# EAGLE design heart-shaped-smd-light-gift (EAGLE 9.2.0)
CNAME: Máté Horváth

## Sheet 1 of 2
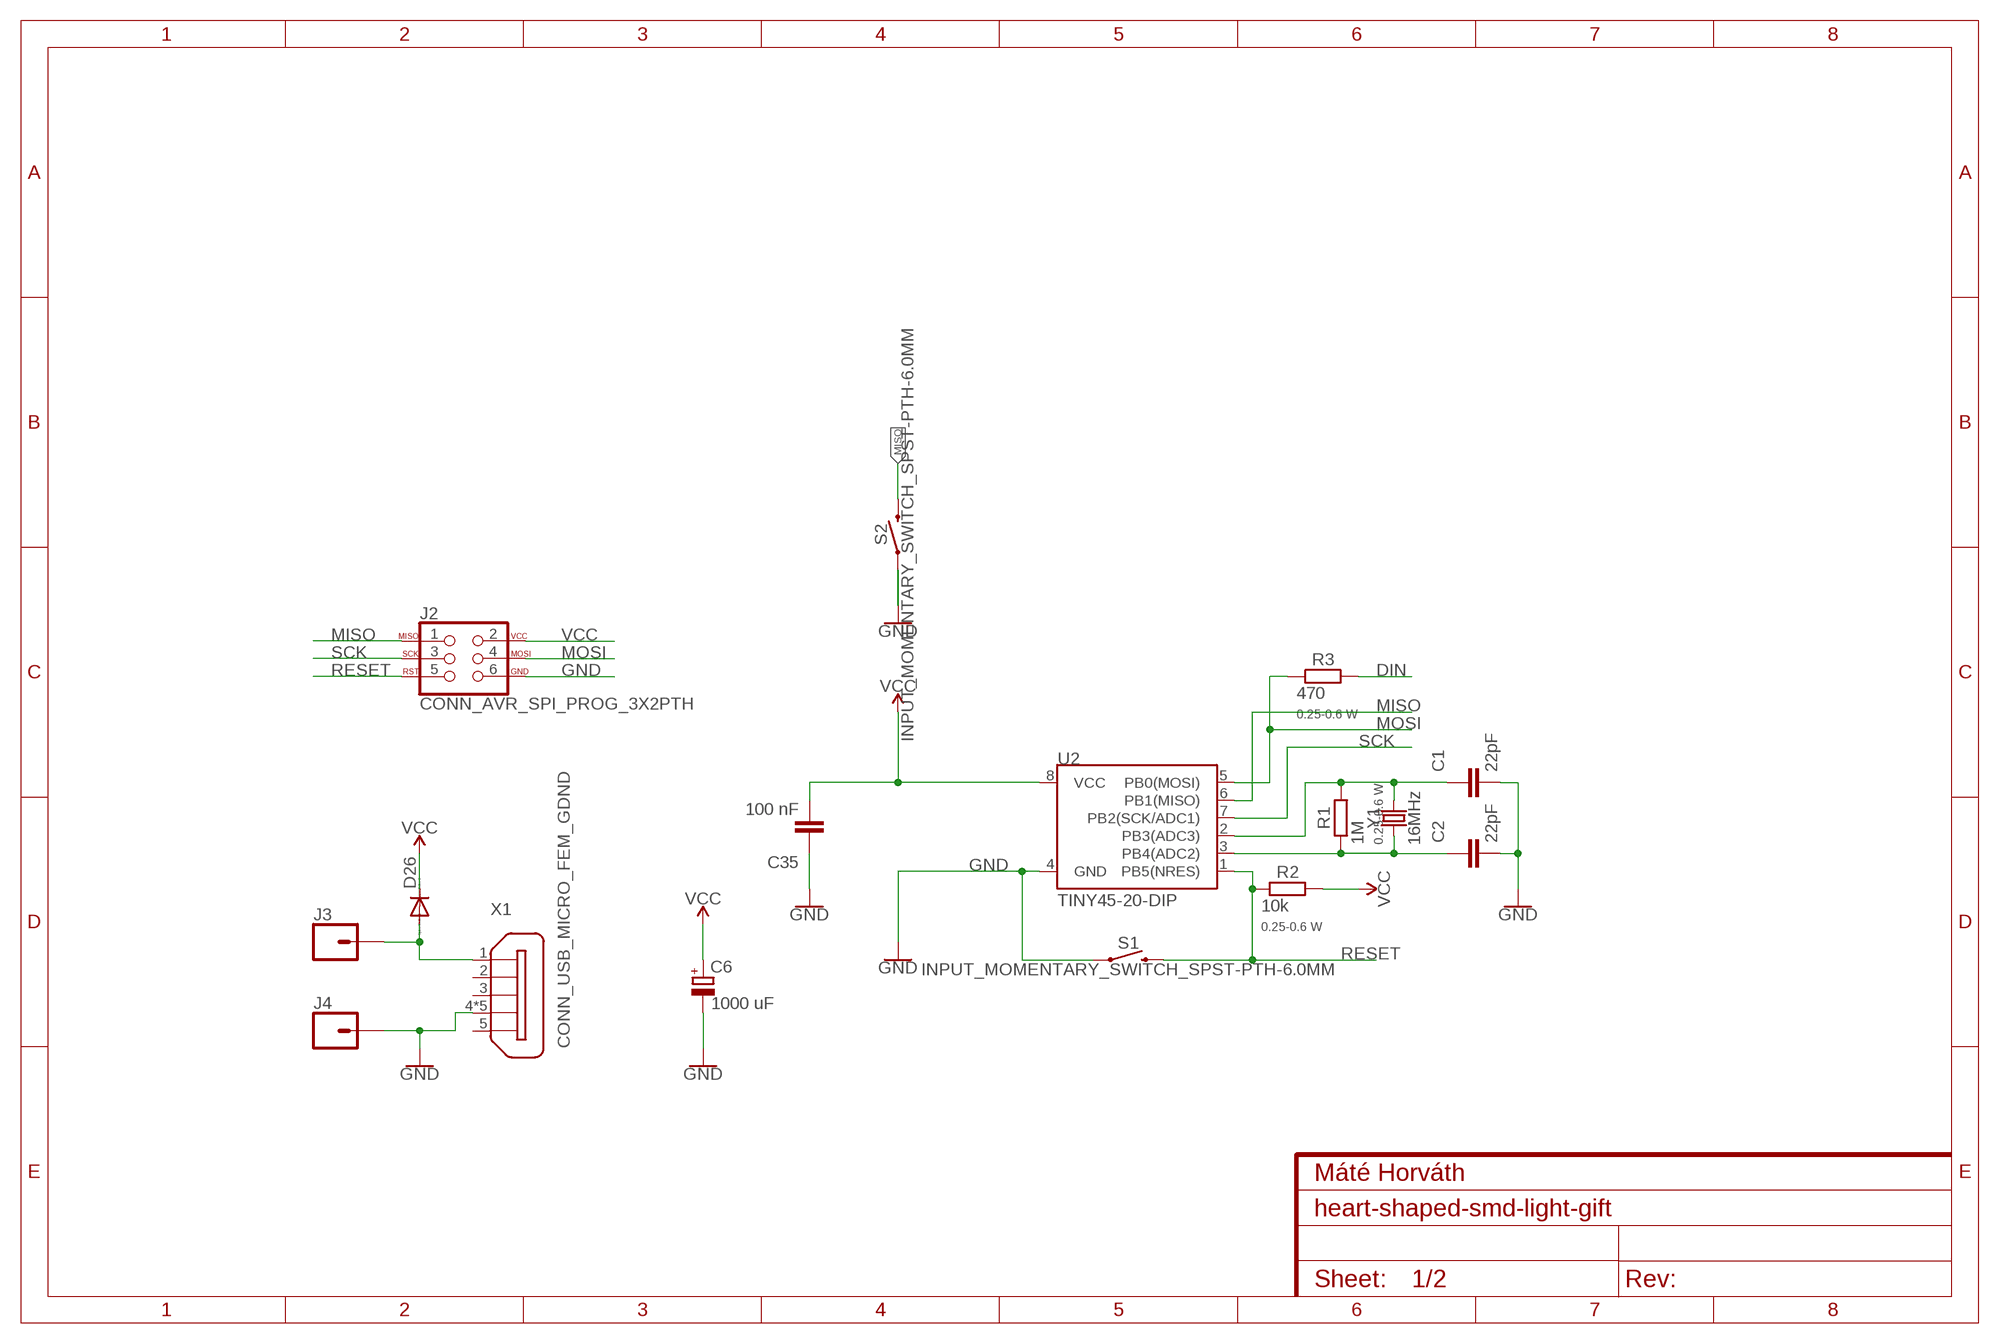
[diagram p0: schematic, sheet 1]

### Parts
C1  22pF  CAPACITOR_1C1206  [C1206I-C3216M]
C2  22pF  CAPACITOR_1C1206  [C1206I-C3216M]
C6  1000 uF  CAPACITOR_POLARIZED153CLV-1010  [153CLV-1010]
C35  100 nF  CAPACITOR_1C1206  [C1206I-C3216M]
D26  DIODED-7.5  [D-7.5]
J2  CONN_AVR_SPI_PROG_3X2PTH  [2X3_S]
J3  CONN_01SNAP-MALE  [SNAP-MALE]
J4  CONN_01SNAP-MALE  [SNAP-MALE]
R1  1M  RESISTOR0207/7  [0207/7]
R2  10k  RESISTOR0207/7  [0207/7]
R3  470  RESISTOR0207/7  [0207/7]
S1  INPUT_MOMENTARY_SWITCH_SPST-PTH-6.0MM  [TACTILE_SWITCH_PTH_6.0MM]
S2  INPUT_MOMENTARY_SWITCH_SPST-PTH-6.0MM  [TACTILE_SWITCH_PTH_6.0MM]
U2  TINY45-20-DIP  MCU_ATTINY45TINY45-20-DIP  [DIP08]
X1  CONN_USB_MICRO_FEM_GDND  [ZX62D-B-5PA8]
Y1  16MHz  CRYSTALPTH-HC49US  [HC49US]

### Nets
DIN: R3.2 ; also sheet 2
GND: C1.2 C2.2 C6.- C35.1 J2.6 J4.2 S1.1 S2.1 U2.4(GND) X1.4 X1.S1 X1.S2 X1.S3 X1.S4 ; also sheet 2
MISO: J2.1 S2.3 U2.6(PB1(MISO))
MOSI: J2.4 R3.1 U2.5(PB0(MOSI))
N$1: C2.1 R1.1 U2.3(PB4(ADC2)) Y1.1
N$2: C1.1 R1.2 U2.2(PB3(ADC3)) Y1.2
N$23: D26.A J3.2 X1.1
RESET: J2.5 R2.1 S1.3 U2.1(PB5(NRES))
SCK: J2.3 U2.7(PB2(SCK/ADC1))
VCC: C6.+ C35.2 D26.C J2.2 R2.2 U2.8(VCC) ; also sheet 2
Unconnected: X1.2 X1.3 X1.5

## Sheet 2 of 2
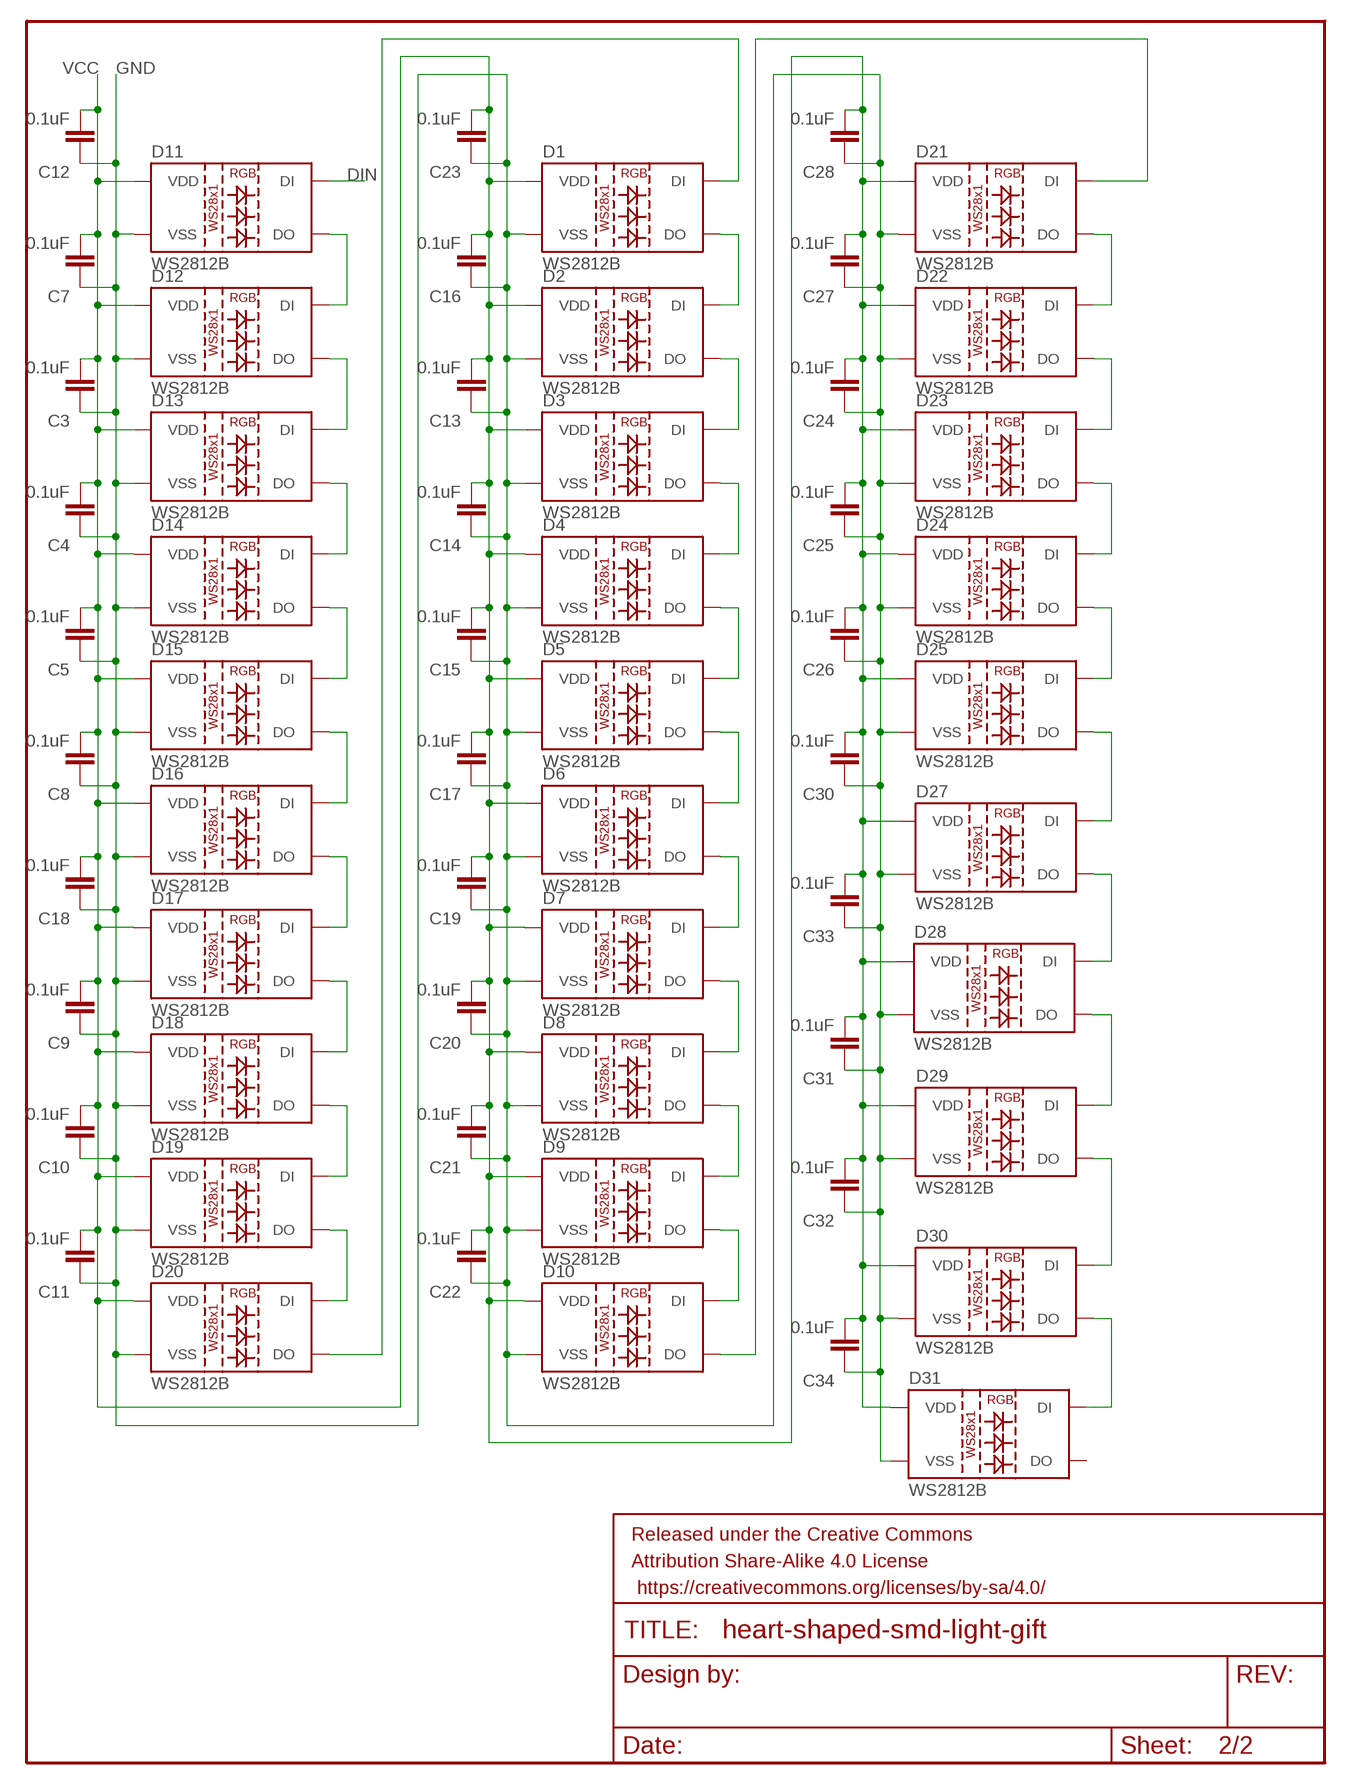
[diagram p1: schematic, sheet 2]

### Parts
C3  0.1uF  CAPACITOR_1C1206  [C1206I-C3216M]
C4  0.1uF  CAPACITOR_1C1206  [C1206I-C3216M]
C5  0.1uF  CAPACITOR_1C1206  [C1206I-C3216M]
C7  0.1uF  CAPACITOR_1C1206  [C1206I-C3216M]
C8  0.1uF  CAPACITOR_1C1206  [C1206I-C3216M]
C9  0.1uF  CAPACITOR_1C1206  [C1206I-C3216M]
C10  0.1uF  CAPACITOR_1C1206  [C1206I-C3216M]
C11  0.1uF  CAPACITOR_1C1206  [C1206I-C3216M]
C12  0.1uF  CAPACITOR_1C1206  [C1206I-C3216M]
C13  0.1uF  CAPACITOR_1C1206  [C1206I-C3216M]
C14  0.1uF  CAPACITOR_1C1206  [C1206I-C3216M]
C15  0.1uF  CAPACITOR_1C1206  [C1206I-C3216M]
C16  0.1uF  CAPACITOR_1C1206  [C1206I-C3216M]
C17  0.1uF  CAPACITOR_1C1206  [C1206I-C3216M]
C18  0.1uF  CAPACITOR_1C1206  [C1206I-C3216M]
C19  0.1uF  CAPACITOR_1C1206  [C1206I-C3216M]
C20  0.1uF  CAPACITOR_1C1206  [C1206I-C3216M]
C21  0.1uF  CAPACITOR_1C1206  [C1206I-C3216M]
C22  0.1uF  CAPACITOR_1C1206  [C1206I-C3216M]
C23  0.1uF  CAPACITOR_1C1206  [C1206I-C3216M]
C24  0.1uF  CAPACITOR_1C1206  [C1206I-C3216M]
C25  0.1uF  CAPACITOR_1C1206  [C1206I-C3216M]
C26  0.1uF  CAPACITOR_1C1206  [C1206I-C3216M]
C27  0.1uF  CAPACITOR_1C1206  [C1206I-C3216M]
C28  0.1uF  CAPACITOR_1C1206  [C1206I-C3216M]
C30  0.1uF  CAPACITOR_1C1206  [C1206I-C3216M]
C31  0.1uF  CAPACITOR_1C1206  [C1206I-C3216M]
C32  0.1uF  CAPACITOR_1C1206  [C1206I-C3216M]
C33  0.1uF  CAPACITOR_1C1206  [C1206I-C3216M]
C34  0.1uF  CAPACITOR_1C1206  [C1206I-C3216M]
D1  WS2812B  LED_SMD_RGB_WS2812B  [WS2812B]
D2  WS2812B  LED_SMD_RGB_WS2812B  [WS2812B]
D3  WS2812B  LED_SMD_RGB_WS2812B  [WS2812B]
D4  WS2812B  LED_SMD_RGB_WS2812B  [WS2812B]
D5  WS2812B  LED_SMD_RGB_WS2812B  [WS2812B]
D6  WS2812B  LED_SMD_RGB_WS2812B  [WS2812B]
D7  WS2812B  LED_SMD_RGB_WS2812B  [WS2812B]
D8  WS2812B  LED_SMD_RGB_WS2812B  [WS2812B]
D9  WS2812B  LED_SMD_RGB_WS2812B  [WS2812B]
D10  WS2812B  LED_SMD_RGB_WS2812B  [WS2812B]
D11  WS2812B  LED_SMD_RGB_WS2812B  [WS2812B]
D12  WS2812B  LED_SMD_RGB_WS2812B  [WS2812B]
D13  WS2812B  LED_SMD_RGB_WS2812B  [WS2812B]
D14  WS2812B  LED_SMD_RGB_WS2812B  [WS2812B]
D15  WS2812B  LED_SMD_RGB_WS2812B  [WS2812B]
D16  WS2812B  LED_SMD_RGB_WS2812B  [WS2812B]
D17  WS2812B  LED_SMD_RGB_WS2812B  [WS2812B]
D18  WS2812B  LED_SMD_RGB_WS2812B  [WS2812B]
D19  WS2812B  LED_SMD_RGB_WS2812B  [WS2812B]
D20  WS2812B  LED_SMD_RGB_WS2812B  [WS2812B]
D21  WS2812B  LED_SMD_RGB_WS2812B  [WS2812B]
D22  WS2812B  LED_SMD_RGB_WS2812B  [WS2812B]
D23  WS2812B  LED_SMD_RGB_WS2812B  [WS2812B]
D24  WS2812B  LED_SMD_RGB_WS2812B  [WS2812B]
D25  WS2812B  LED_SMD_RGB_WS2812B  [WS2812B]
D27  WS2812B  LED_SMD_RGB_WS2812B  [WS2812B]
D28  WS2812B  LED_SMD_RGB_WS2812B  [WS2812B]
D29  WS2812B  LED_SMD_RGB_WS2812B  [WS2812B]
D30  WS2812B  LED_SMD_RGB_WS2812B  [WS2812B]
D31  WS2812B  LED_SMD_RGB_WS2812B  [WS2812B]
FRAME2  FRAME_LETTERNO_PACKAGE  [DUMMY]

### Nets
DIN: D11.4(DI) ; also sheet 1
DIN2: D10.2(DO) D21.4(DI)
GND: C3.1 C4.1 C5.1 C7.1 C8.1 C9.1 C10.1 C11.1 C12.1 C13.1 C14.1 C15.1 C16.1 C17.1 C18.1 C19.1 C20.1 C21.1 C22.1 C23.1 C24.1 C25.1 C26.1 C27.1 C28.1 C30.1 C31.1 C32.1 C33.1 C34.1 D1.3(VSS) D2.3(VSS) D3.3(VSS) D4.3(VSS) D5.3(VSS) D6.3(VSS) D7.3(VSS) D8.3(VSS) D9.3(VSS) D10.3(VSS) D11.3(VSS) D12.3(VSS) D13.3(VSS) D14.3(VSS) D15.3(VSS) D16.3(VSS) D17.3(VSS) D18.3(VSS) D19.3(VSS) D20.3(VSS) D21.3(VSS) D22.3(VSS) D23.3(VSS) D24.3(VSS) D25.3(VSS) D27.3(VSS) D28.3(VSS) D29.3(VSS) D30.3(VSS) D31.3(VSS) ; also sheet 1
N$3: D18.2(DO) D19.4(DI)
N$4: D1.2(DO) D2.4(DI)
N$5: D2.2(DO) D3.4(DI)
N$6: D3.2(DO) D4.4(DI)
N$7: D4.2(DO) D5.4(DI)
N$8: D5.2(DO) D6.4(DI)
N$9: D11.2(DO) D12.4(DI)
N$10: D6.2(DO) D7.4(DI)
N$11: D12.2(DO) D13.4(DI)
N$12: D7.2(DO) D8.4(DI)
N$13: D8.2(DO) D9.4(DI)
N$14: D9.2(DO) D10.4(DI)
N$15: D1.4(DI) D20.2(DO)
N$16: D21.2(DO) D22.4(DI)
N$17: D13.2(DO) D14.4(DI)
N$18: D14.2(DO) D15.4(DI)
N$19: D22.2(DO) D23.4(DI)
N$20: D15.2(DO) D16.4(DI)
N$21: D16.2(DO) D17.4(DI)
N$22: D17.2(DO) D18.4(DI)
N$24: D19.2(DO) D20.4(DI)
N$25: D23.2(DO) D24.4(DI)
N$26: D24.2(DO) D25.4(DI)
N$30: D25.2(DO) D27.4(DI)
N$31: D27.2(DO) D28.4(DI)
N$32: D28.2(DO) D29.4(DI)
N$33: D29.2(DO) D30.4(DI)
N$34: D30.2(DO) D31.4(DI)
VCC: C3.2 C4.2 C5.2 C7.2 C8.2 C9.2 C10.2 C11.2 C12.2 C13.2 C14.2 C15.2 C16.2 C17.2 C18.2 C19.2 C20.2 C21.2 C22.2 C23.2 C24.2 C25.2 C26.2 C27.2 C28.2 C30.2 C31.2 C32.2 C33.2 C34.2 D1.1(VDD) D2.1(VDD) D3.1(VDD) D4.1(VDD) D5.1(VDD) D6.1(VDD) D7.1(VDD) D8.1(VDD) D9.1(VDD) D10.1(VDD) D11.1(VDD) D12.1(VDD) D13.1(VDD) D14.1(VDD) D15.1(VDD) D16.1(VDD) D17.1(VDD) D18.1(VDD) D19.1(VDD) D20.1(VDD) D21.1(VDD) D22.1(VDD) D23.1(VDD) D24.1(VDD) D25.1(VDD) D27.1(VDD) D28.1(VDD) D29.1(VDD) D30.1(VDD) D31.1(VDD) ; also sheet 1
Unconnected: D31.2(DO)

## Library data of the parts
C1-C5 C7-C28 C30-C35 = 006-rcl:CAPACITOR_1: CAPACITOR, European symbol; SPICEPREFIX: C
C6 = 006-rcl:CAPACITOR_POLARIZED: POLARIZED CAPACITOR, European symbol; SPICEPREFIX: C
D1-D25 D27-D31 = 009-led:LED_SMD_RGB_WS2812B: WS2812B SMD addressable RGB LED 5x5mm SMD LED with built-in controller IC. Color: Red/Green/Blue mC Rating: RGB: 390, 660, 180 mcd Forward Voltage: RGB: 2.0, 3.0, 3.0 V Packages:WS2812B SparkFun Products: Blynk Board - ESP8266 <https://www.sparkfun.com/products/13794>; PROD_ID: DIO-12503
D26 = 13-diode:DIODE: DIODE
FRAME2 = 001-private-inventory:FRAME_LETTER: Schematic Frame - Letter Standard 8.5x11 US Letter frame; DESIGNER: Nobody; VERSION: v01
J2 = 007-connectors:CONN_AVR_SPI_PROG_3X2: AVR ISP 6 Pin This is the reduced ISP connector for AVR programming. Common on Arduino. This footprint will take up less PCB space and can be used with a 10-pin to 6-pin adapter such as SKU: BOB-08508 **Special note about "TEST_POINT" package. The stop mask is on the top side, so if you want your programming test points to be on the bottom of your board, make sure to place this package on the bottom side of the board. This also ensure that the orientation to program from the bottom side will be correct. SparkFun Products: SparkFun ISP Pogo Adapter <https://www.sparkfun.com/products/11591> - NS Tiny AVR Programmer <https://www.sparkfun.com/products/11801> -PTH
J3 J4 = 007-connectors:CONN_01: Single connection point. Often used as Generic Header-pin footprint for 0.1 inch spaced/style header connections On any of the 0.1 inch spaced packages, you can populate with these: Break Away Headers - Straight <https://www.sparkfun.com/products/116> (PRT-00116) Break Away Male Headers - Right Angle <https://www.sparkfun.com/products/553> (PRT-00553) Female Headers <https://www.sparkfun.com/products/115> (PRT-00115) Break Away Headers - Machine Pin <https://www.sparkfun.com/products/117> (PRT-00117) Break Away Female Headers - Swiss Machine Pin <https://www.sparkfun.com/products/743> (PRT-00743) This device is also useful as a general connection point to wire up your design to another part of your project. Our various solder wires solder well into these plated through hole pads. Hook-Up Wire - Assortment (Stranded, 22 AWG) <https://www.sparkfun.com/products/11375> (PRT-11375) Hook-Up Wire - Assortment (Solid Core, 22 AWG) <https://www.sparkfun.com/products/11367> (PRT-11367) View the entire wire category on our website here <https://www.sparkfun.com/categories/141> Special notes: SMTSO-256-ET is a "flush mount" nut for a 4-40 screw. We mostly use this on specialty testbeds; it is a nice way to connect hardware to your PCB at an adjustable hieght. Also note, the SNAP packages are for using a snappable style connector. We sell a baggie of snaps and they are also used on two LilyPad designs: Snap Assortment - 30 pack (male and female) <https://www.sparkfun.com/products/11347> (DEV-11347) LilyPad Arduino SimpleSnap <https://www.sparkfun.com/products/10941> (DEV-10941) LilyPad SimpleSnap Protoboard <https://www.sparkfun.com/products/10940> (DEV-10940)
R1-R3 = 006-rcl:RESISTOR: RESISTOR, European symbol; POWER: 0.25-0.6 W; SPICEPREFIX: R
S1 S2 = 010-inputs:INPUT_MOMENTARY_SWITCH_SPST: Momentary Switch (Pushbutton) - SPST Normally-open (NO) SPST momentary switches (buttons, pushbuttons). Variants PTH-12MM - 12mm square, through-hole Momentary Pushbutton Switch - 12mm Square <https://www.sparkfun.com/products/9190> (COM-09190) PTH-6.0MM, PTH-6.0MM-KIT - 6.0mm square, through-hole Mini Pushbutton Switch <https://www.sparkfun.com/products/97> (COM-00097) KIT package intended for soldering kit's - only one side of pads' copper is exposed. PTH-RIGHT-ANGLE-KIT - Right-angle, through-hole Right Angle Tactile Button <https://www.sparkfun.com/products/10791> - Used on SparkFun BigTime Watch Kit <https://www.sparkfun.com/products/11734> SMD-12MM - 12mm square, surface-mount Tactile Button - SMD (12mm) <https://www.sparkfun.com/products/12993> (COM-12993) Used on SparkFun PicoBoard <https://www.sparkfun.com/products/11888> SMD-4.5MM - 4.5mm Square Trackball Switch Used on SparkFun Blackberry Trackballer Breakout <https://www.sparkfun.com/products/13169> SMD-4.6MMX2.8MM - 4.60mm x 2.80mm, surface mount Used on SparkFun SAMD21 Mini Breakout <https://www.sparkfun.com/products/13664> SMD-5.2MM, SMD-5.2-REDUNDANT - 5.2mm square, surface-mount Mini Pushbutton Switch - SMD <https://www.sparkfun.com/products/8720> (COM-08720) Used on Arduino Pro Mini <https://www.sparkfun.com/products/11114> REDUNDANT package connects both switch circuits together SMD-6.0X3.5MM - 6.0 x 3.5mm, surface mount Momentary Reset Switch SMD <https://www.sparkfun.com/products/8229> (COM-08229) SMD-6.2MM-TALL - 6.2mm square, surface mount Tactile Button - SMD (6mm) <https://www.sparkfun.com/products/12992> Used on SparkFun Digital Sandbox <https://www.sparkfun.com/products/12651> SMD-RIGHT-ANGLE - Right-angle, surface mount Used on SparkFun Block for Intel® Edison - Arduino <https://www.sparkfun.com/products/13036>; PROD_ID: SWCH-08441; SF_SKU: COM-00097
U2 = 008-mcu:MCU_ATTINY45: Atmel 8-pin 2/4/8kB flash uC Retired; PROD_ID: IC-09439
X1 = 007-connectors:CONN_USB_MICRO_FEM_GDND: Micro USB Type B Connector - Standard, Shell Through Hole Source: http://www.hirose.co.jp/cataloge_hp/ed_ZX_20140804.pdf; MF: Hirose; MPN: ZX62D-B-5PA8; OC_FARNELL: 2300438; OC_NEWARK: 69W0712
Y1 = 001-private-inventory:CRYSTAL: Crystals (Generic) These are passive quartz crystals, which can be used as a clock source for a microcontroller. Crystal's are two-terminal devices. They require external "load" capacitors to generate an oscillating signal.

## Board
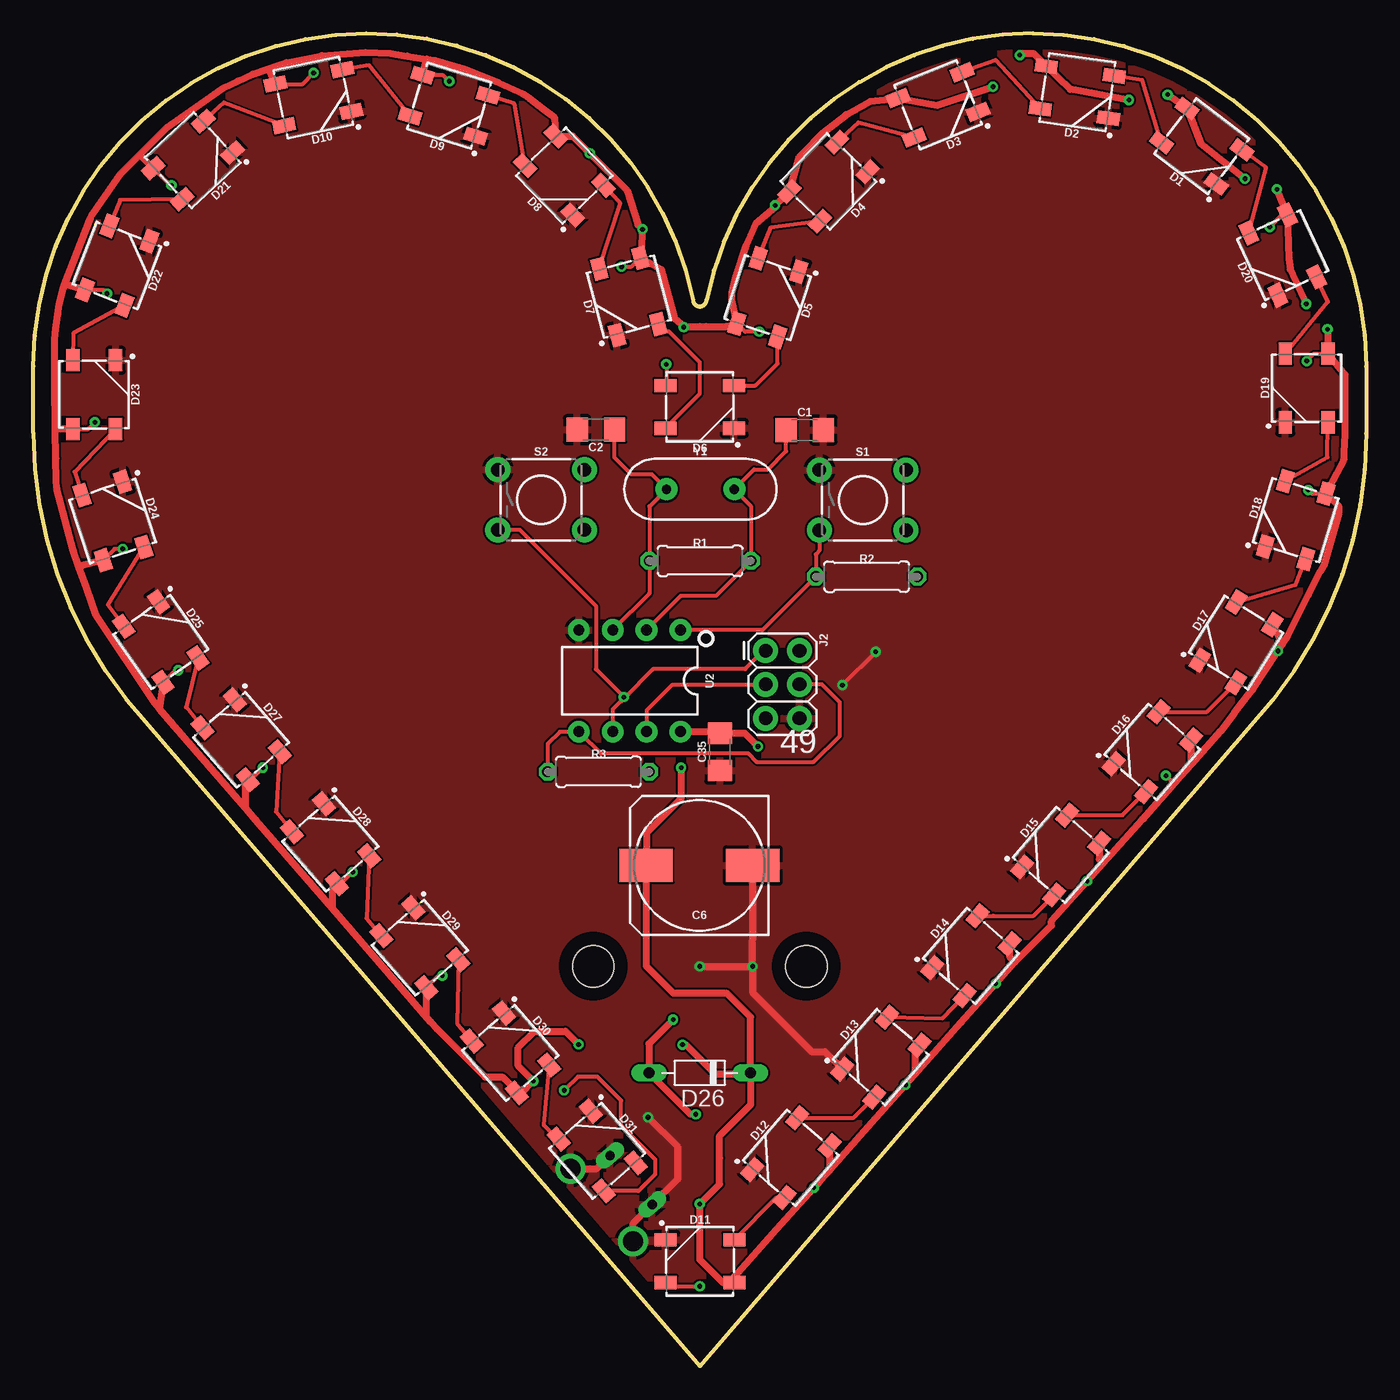
[diagram p2: board, top side]
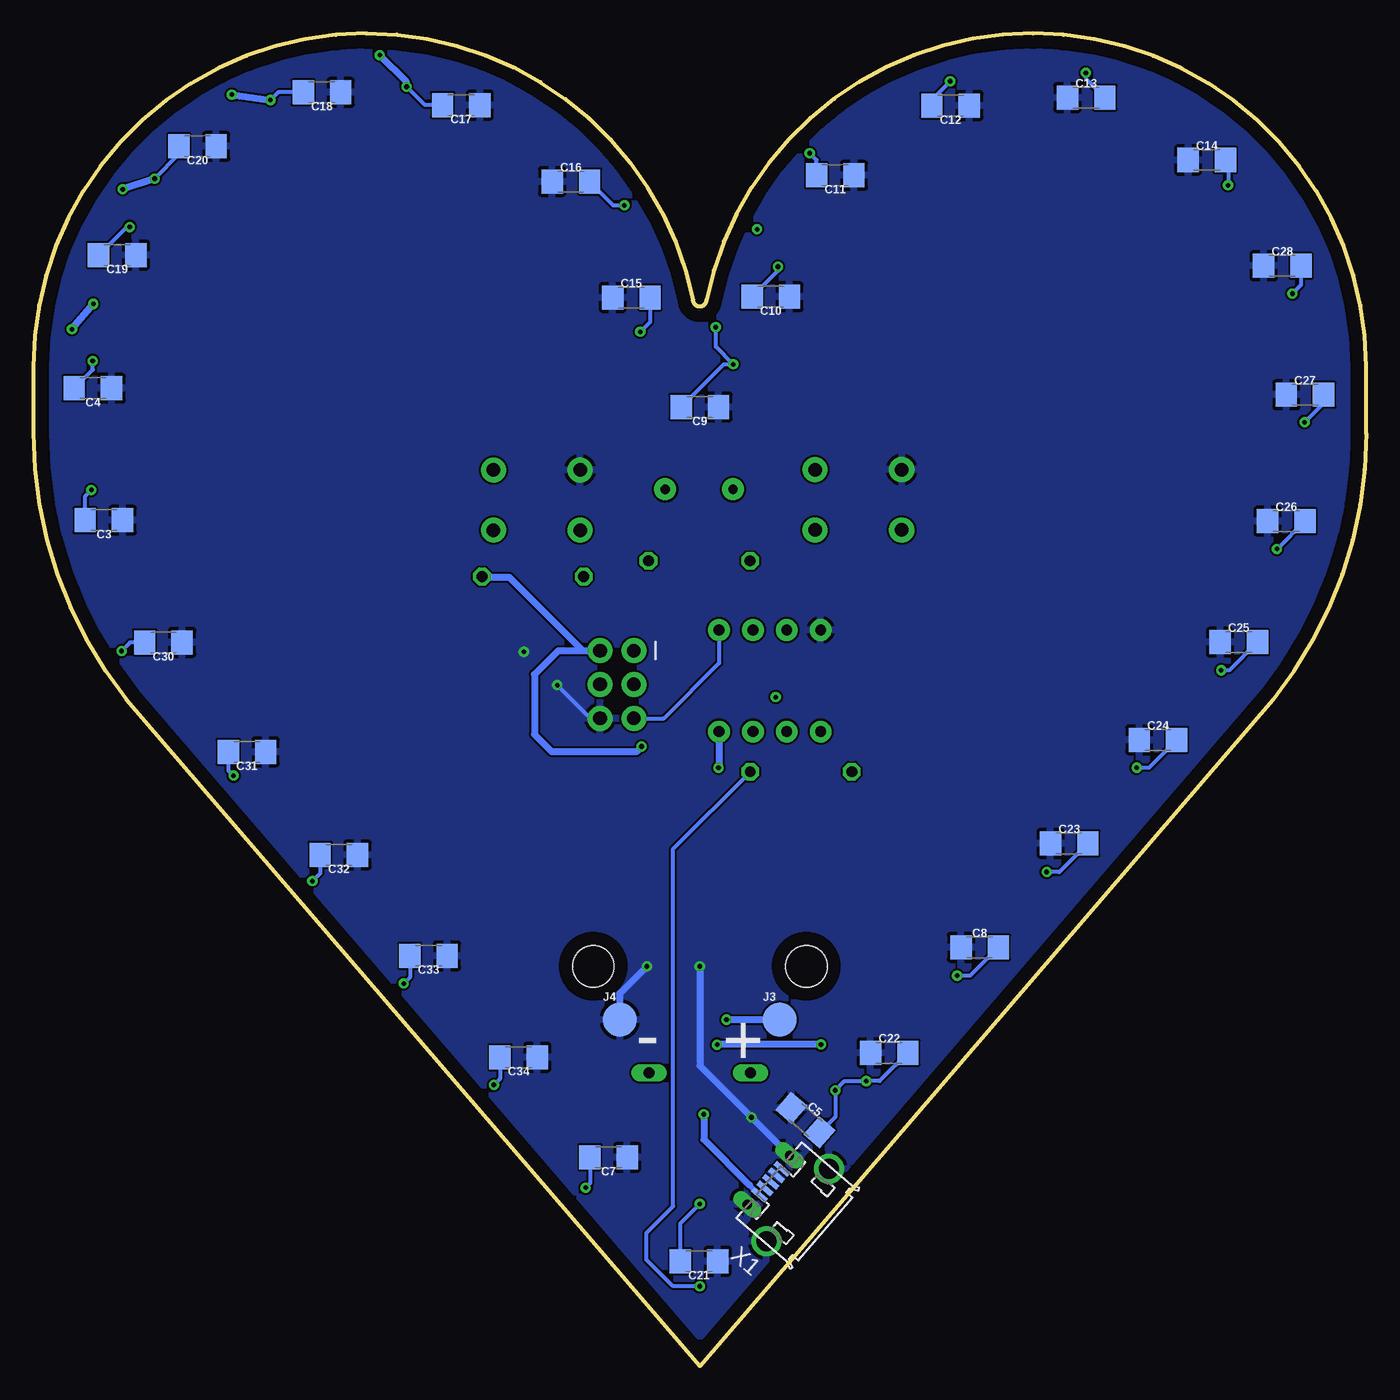
[diagram p3: board, bottom side, seen from below]

Size 100 x 100 mm. Coordinates in mm from the lower left corner, seen from the top.
Outline: 0,70 0,75 arc-90 25,100 arc-79 49.5,80 arc90 50,79.5 arc90 50.5,80 arc-78 75,100 arc-90 100,75 100,70 arc-39 93,50 50,0 7,50 arc-39 0,70
Copper layers (1*16): Top 0.035mm / dielectric 1.5mm / Bottom 0.035mm
Design rules "default": minimum track width 6mil, minimum drill 0.35mm, track to track 6mil, track to pad 6mil, pad to pad 6mil, via to via 6mil, smd to smd 6mil, copper to edge 40mil, drill to drill 6mil, minimum pad ring 10mil, minimum via ring 8mil, stop-mask expansion 4mil, vias tented up to drill 0mil, thermal gap 10mil
Holes 3.1 mm at 42,30 58,30

### Footprints (pad centres in the part's own frame; a part is rotated, then mirrored left to right if it is on the bottom)
C1206I-C3216M = smd 1.6 x 1.8: 1 -1.4,0; 2 1.4,0
153CLV-1010 = smd 4 x 2.5: + 4,0; - -4,0
WS2812B = smd 1.651 x 1: 1 2.577,-1.6; 2 2.577,1.6; 3 -2.577,1.6; 4 -2.577,-1.6
D-7.5 = drill 0.813 long: A 3.81,0; C -3.81,0
2X3_S = drill 1.016 pad 1.88: 1 0,0; 2 0,2.54; 3 2.54,0; 4 2.54,2.54; 5 5.08,0; 6 5.08,2.54
SNAP-MALE = smd 2.54 x 2.54: 2 0,0
0207/7 = drill 0.813 octagon: 1 -3.81,0; 2 3.81,0
TACTILE_SWITCH_PTH_6.0MM = drill 1.016 pad 1.88: 1 -3.251,2.261; 2 3.251,2.261; 3 -3.251,-2.261; 4 3.251,-2.261
DIP08 = drill 0.813 pad 1.626: 1 -3.81,-3.81; 2 -1.27,-3.81; 3 1.27,-3.81; 4 3.81,-3.81; 5 3.81,3.81; 6 1.27,3.81; 7 -1.27,3.81; 8 -3.81,3.81
ZX62D-B-5PA8 = smd 1.35 x 0.4: 1 4.825,1.3; 2 4.825,0.65; 3 4.825,0; 4 4.825,-0.65; 5 4.825,-1.3 | drill 1.5: S1 2.15,-3.6; S2 2.15,3.6 | drill 0.7 long: S3 5.05,2.425; S4 5.05,-2.425
HC49US = drill 0.7 pad 1.651: 1 -2.54,0; 2 2.54,0

### Placement (x,y rotation side)
C1  57.88,70.24 0 top
C2  42.2,70.26 180 top
C3  94.7,63.47 180 bottom
C4  95.53,73.37 180 bottom
C5  42.07,18.46 319 bottom
C6  49.97,37.57 180 top
C7  56.84,15.67 180 bottom
C8  29,31.42 0 bottom
C9  50,71.96 180 bottom
C10  44.67,80.24 180 bottom
C11  39.83,89.35 180 bottom
C12  31.18,94.57 180 bottom
C13  21.01,95.17 0 bottom
C14  11.96,90.5 0 bottom
C15  55.13,80.17 0 bottom
C16  59.67,88.87 0 bottom
C17  67.9,94.62 180 bottom
C18  78.35,95.58 180 bottom
C19  93.71,83.37 180 bottom
C20  87.68,91.53 180 bottom
C21  50.05,7.87 180 bottom
C22  35.78,23.52 0 bottom
C23  22.28,39.22 0 bottom
C24  15.62,46.99 0 bottom
C25  9.56,54.33 0 bottom
C26  5.99,63.4 0 bottom
C27  4.59,72.88 0 bottom
C28  6.29,82.56 0 bottom
C30  90.24,54.3 180 bottom
C31  83.97,46.09 180 bottom
C32  77.08,38.36 180 bottom
C33  70.35,30.8 180 bottom
C34  63.59,23.18 180 bottom
C35  51.5,46.1 90 top
D1  87.66,91.53 143 top
D2  78.32,95.58 172 top
D3  67.89,94.63 202 top
D4  59.66,88.87 226 top
D5  55.11,80.17 252 top
D6  50,71.97 180 top
D7  44.67,80.25 105 top
D8  39.83,89.33 134 top
D9  31.19,94.57 163 top
D10  21.01,95.17 192 top
D11  50.02,7.88 0 top
D12  56.84,15.65 49 top
D13  63.59,23.19 49 top
D14  70.35,30.8 49 top
D15  77.08,38.35 49 top
D16  83.96,46.1 49 top
D17  90.24,54.3 58 top
D18  94.7,63.48 73 top
D19  95.53,73.39 90 top
D20  93.73,83.37 115 top
D21  11.96,90.48 223 top
D22  6.28,82.57 249 top
D23  4.57,72.89 270 top
D24  5.97,63.41 288 top
D25  9.57,54.33 305 top
D26  50,22 180 top
D27  15.6,47 311 top
D28  22.3,39.2 311 top
D29  29,31.4 311 top
D30  35.8,23.5 311 top
D31  42.31,16.15 311 top
FRAME2  -12,-2 0 top  (outside the outline)
J2  54.94,53.69 270 top
J3  44,26 0 bottom
J4  56,26 0 bottom
R1  50.03,60.42 0 top
R2  62.52,59.24 0 top
R3  42.4,44.6 0 top
S1  62.23,64.98 0 top
S2  38.1,65 0 top
U2  44.74,51.42 180 top
X1  41.02,10.68 139.3 bottom
Y1  50.05,65.79 0 top

### Tracks (layer width: path | path; a pad name or v marks a point on that pad's centre or on a via)
DIN  (via drill 0.35)
  Top 0.305: D11.4 47.72,6 v50,6
  Bottom 0.305: v50,6 52,6 54,8 54,10 52,12 52,38.81 R3.2
DIN2
  Top 0.305: D10.2 14.3,94.8 D21.4
GND  (via drill 0.35)
  Top 0.305: v63.2,53.6 v60.7,51.1
  Top 0.508: v53.97,30 53.97,28.03 J4.2 58.4,23.6 59.39,23.6 D13.3 | v53.97,30 53.97,32 C6.- | v50,30 v53.97,30 | v46.12,18.67 46.13,18.67 48.35,16.45 48.35,14.05 X1.S3 45,10.7 X1.S2 | X1.S1 42.27,14.81 X1.S4
  Bottom 0.305: J2.6 58.21,48.61 v60.7,51.1
  Bottom 0.508: X1.S4 v46.12,18.67 50,22.54 v50,30 | J4.2 56,27.97 v53.97,30
  pour Bottom: 50,0 7.3,49.6 arc-38 0,68 0,75 arc-90 25,100 arc-77 49.4,80.6 arc-7 49.5,80 arc168 50.5,80 arc-24 52.1,84.9 52.7,86.2 53.6,88 arc-24 57.7,93.1 arc-11 65.1,98 arc-21 69.9,99.5 arc-2 74.8,100 arc-18 79,99.7 arc-6 85.3,97.9 arc-20 88.2,96.3 arc7 92,93.6 93.6,91.9 95.8,89 97.3,86.4 98.6,83.7 99.9,77.57 99.9,71.6 99.9,68.23 arc-27 97.18,57.06 95.5,53.6 93.8,51 88.1,44.2 50,0.1
  pour Top: 50,0 7.1,49.9 arc-39 0.1,67.8 0.1,75.3 arc-90 24.8,100 arc-77 49.4,80.5 arc2 49.5,80.1 arc150 50.5,80.1 arc-32 58.7,93.8 arc-45 75.13,99.97 arc-86 100,75.3 arc-14 98.77,60.84 98.1,59 96.9,56.1 94.6,52.1 93.2,50.1 91.2,47.8
MISO  (via drill 0.35)
  Top 0.305: J2.1 54.79,53.69 53.4,52.3 46.5,52.3 44.3,50.1 | 44.3,50.1 44.1,49.9 43.47,49.27 U2.6 | S2.3 36.5,62.74 42.2,57.04 42.2,52.3 v44.3,50.2 44.3,50.1
MOSI
  Top 0.305: J2.4 59.15,51.15 60.5,49.8 60.5,47.3 58.54,45.34 54.26,45.34 53.6,46 42.54,46 41.07,47.47 | 41.07,47.47 U2.5 | R3.1 38.59,46.69 39.5,47.6 U2.5 41.07,47.47
N$1
  Top 0.305: U2.3 46.22,57.98 R1.1 46.22,64.5 Y1.1 46.4,66.9 44.87,66.9 43.6,68.17 C2.1
N$2
  Top 0.305: U2.2 48.57,57.79 51.21,57.79 R1.2 53.84,64.54 Y1.2 54.07,67.27 55.1,67.27 56.48,68.65 C1.1
N$3
  Top 0.305: D18.2 97.1,68.19 D19.4
N$4
  Top 0.305: D1.2 83.2,96.5 D2.4
N$5
  Top 0.305: D2.2 72.2,98 D3.4
N$6
  Top 0.305: D3.2 61.9,93.3 D4.4
N$7
  Top 0.305: D4.2 55.3,85.4 D5.4
N$8
  Top 0.305: D6.4 54.17,73.57 55.84,75.23 D5.2
N$9
  Top 0.305: D11.2 55.77,12.65 D12.4
N$10
  Top 0.305: D6.2 50,72.98 50,75.3 47.65,77.65 47.41,77.65 D7.4
N$11
  Top 0.305: D12.2 61.55,18.64 D13.4
N$12
  Top 0.305: D7.2 44.05,87.26 D8.4 | D7.2
N$13
  Top 0.305: D8.2 36.1,94.7 D9.4
N$14
  Top 0.305: D9.2 25.2,97.6 D10.4
N$15
  Top 0.305: D20.2 92.5,89.9 D1.4
N$16
  Top 0.305: D21.2 6.5,87.5 D22.4
N$17
  Top 0.305: D13.2 68.2,26.1 D14.4
N$18
  Top 0.305: D14.2 72,33.8 75.04,33.8 D15.4
N$19
  Top 0.305: D22.2 3,77.5 D23.4
N$20
  Top 0.305: D15.2 81.72,41.34 D16.4
N$21
  Top 0.305: D16.2 88.06,49.09 D17.4
N$22
  Top 0.305: D17.2 94.71,58.63 D18.4
N$23  (via drill 0.35)
  Top 0.508: v49.7,18.9 49.29,18.9 D26.A 46.19,24.19 v48,26
  Bottom 0.406: X1.1 46.27,13.58
  Bottom 0.508: v49.7,18.9 49.7,17.02 46.27,13.58 | J3.2 v48,26
N$24
  Top 0.305: D19.2 97.13,79.86 D20.4
N$25
  Top 0.305: D23.2 3.1,67.1 D24.4
N$26
  Top 0.305: D24.2 5.59,57.12 D25.4
N$30
  Top 0.305: D25.2 11.46,49.45 D27.4
N$31
  Top 0.305: D27.2 18.2,41.6 D28.4
N$32
  Top 0.305: D28.2 25,33.6 D29.4
N$33
  Top 0.305: D29.2 31.8,25.7 D30.4
N$34
  Top 0.305: D30.2 38.28,18.11 39.14,17.19 39.14,16.77 D31.4
RESET
  Top 0.305: U2.1 54.7,55.23 R2.1 58.7,60.9 58.98,61.18 S1.3
  Bottom 0.305: U2.1 48.55,52.75 52.7,48.6 J2.5
SCK
  Top 0.305: J2.3 54.89,51.1 47.9,51.1 46.01,49.21 U2.7
VCC  (via drill 0.35)
  Top 0.305: 85.58,43.7 v84.98,44.3 | v95.65,65.74 95.91,65.48 D18.1 | v95.54,75.42 96.09,75.97 D19.1 | v92.77,85.47 93.68,86.38 D20.1 | v54.46,77.61 53.4,77.61 D5.1 | v44.13,82.5 44.89,82.5 D7.1 | v31.21,96.4 30.76,96.85 D9.1 | D10.1 20.2,96.2 v21.03,97.03 | v10.36,88.6 10.28,88.6 D21.1 | v5.53,80.47 5.26,80.74 D22.1 | D23.1 4.11,70.31 v4.62,70.82 | v6.7,61.32 6.1,61.32 D24.1 | v10.88,52.21 10.65,52.21 D25.1 | v17.22,44.9 16.33,44.01 D27.1 | v23.97,37.08 23.09,36.2 D28.1 | v30.69,29.3 30.38,29.3 D29.1 | D31.1 45.41,13.15 46.68,14.43 46.68,15.49 44.1,18.07 44.1,19.94 42.33,21.71 40.85,21.71 v39.83,20.69 | v47.49,75.17 47.49,73.64 D6.1 | v48.8,77.95 48.8,78
  Top 0.508: 59.5,14.45 59.06,13.96 v58.55,13.39 55.76,10.25 52.6,6.71 D11.1 51.72,6.28 50,8 v50,12.17 51.49,13.66 51.49,15.61 51.49,17.29 53.81,19.61 D26.C | 59.5,14.45 62.92,18.28 v65.44,21.11 66.13,21.89 | 66.13,21.89 69.61,25.79 v72.21,28.71 73.65,30.32 | 80.28,37.75 v79.06,36.39 76.4,33.4 76.4,33.07 73.65,30.32 | 80.28,37.75 83.19,41.02 85.91,44.08 86.12,44.3 | 85.58,43.7 86.12,44.3 | 86.12,44.3 86.91,45.19 | 9.45,49.36 10.36,48.31 15.9,41.91 | 15.9,41.91 16.69,40.99 22.43,34.37 | 22.43,34.37 23.38,33.28 29.82,25.84 | 29.82,25.84 30.29,25.29 33.88,21.7 35.2,21.7 36.28,20.62 D30.1 36.62,20.5 v37.51,21.39 36.37,22.53 36.37,23.91 37.59,25.13 39.92,25.13 v40.91,24.14 v40.91,24.13 | D25.1 9.45,49.36 | D27.1 15.9,43.82 15.9,41.91 | D28.1 22.43,35.85 22.43,34.37 | D29.1 29.48,26.17 29.82,25.84 | D16.1 86.86,46 86.86,45.24 86.91,45.19 | D15.1 79.98,38.05 80.28,37.75 | D14.1 73.25,30.71 73.65,30.32 | D13.1 66.13,23.73 66.13,21.89 | D12.1 59.74,14.69 59.5,14.45 | 86.91,45.19 89.1,47.65 90.09,48.99 91.5,50.8 v93.38,53.66 93.72,54.18 | 93.72,54.18 94.1,54.8 95.66,57.87 96.55,59.61 96.8,60.06 97.93,64.02 97.93,64.54 D18.1 98.3,68 98.33,68.59 98.4,69.9 98.4,74.4 D19.1 v97.1,77.8 | D17.1 93.72,54.18 | D7.1 47.1,82.3 48.1,78.6 48.8,78 50,78 50.5,78 52,78 D5.1 52.4,80 52.4,80.5 52.48,80.83 52.7,81.7 53.5,84.1 54.2,85.7 55.7,87 v55.66,87.09 D4.1 57.48,90.74 57.52,90.78 57.77,91.03 59.2,92.5 61,93.9 62.8,94.9 D3.1 67.8,94.6 v72,96 | 9.45,49.36 9.12,49.76 4.73,56.33 3.99,58.4 3.42,60.01 | 3.42,60.01 3,61.2 1.77,65.84 1.72,66.51 1.69,68.1 1.66,70.3 | 1.66,70.3 1.6,73.8 1.6,77.03 1.64,77.5 1.83,78.91 1.93,79.66 2.25,80.86 2.37,81.17
  Top 0.508: 2.37,81.17 4.29,86.17 4.4,86.4 6.37,89.22 6.54,89.46 7.99,90.91 | 7.99,90.91 10.01,92.93 14.28,95.92 15.35,96.42 16.47,96.94 17.65,97.34 | 17.65,97.34 18.16,97.51 18.17,97.52 19,97.8 21.67,98.33 24.92,98.57 26.77,98.49 28.05,98.29 29.51,98.07 | 29.51,98.07 30.12,97.97 32.27,97.33 34.9,96.3 36.73,95.46 37.24,95.11 38.26,94.34 39.1,93.7 D8.1 40.46,92.3 v41.75,91.01 44.54,88.22 45.36,85.64 v45.7,85.3 D7.1 | D10.1 17.65,97.34 | D21.1 7.99,90.91 | D9.1 29.51,98.07 | D22.1 2.37,81.17 | D23.1 1.66,70.3 | D24.1 3.42,60.01 | v85.1,95.4 D1.1 87.6,91.7 v90.9,89.1 | v82.2,95 77.8,95.8 D2.1 75.03,98.49 74,98.49 v74,98.38 v74.01,98.37 | v93.3,88.3 D20.1 94.2,83.1 94.3,82.3 v95.5,79.7 | D7.1 | v48.6,44.9 48.6,42.6 46,40 46,37.6 C6.+ 45.97,30.03 48,28 52,28 53.81,26.19 D26.C | U2.8 51.39,47.61 C35.2 53.36,47.5 v54.37,46.49 | v48.7,24.12 48.96,24.12 51.15,21.93 53.74,21.93 D26.C
  Bottom 0.305: C21.2 51.45,10.72 v50,12.17 | C7.2 58.24,13.7 v58.55,13.39 | C34.2 64.99,21.56 v65.44,21.11 | C33.2 71.75,29.17 v72.21,28.71 | C32.2 78.48,36.98 v79.06,36.39 | C31.2 85.37,44.69 v84.98,44.3 | C30.2 92.74,54.3 v93.38,53.66 | C3.2 96.1,65.29 v95.65,65.74 | C4.2 95.54,74.76 v95.54,75.42 | C19.2 93.01,85.47 v92.77,85.47 | C20.2 89.08,90.92 v90.9,89.1 | C18.2 81.62,95.58 v82.2,95 | C17.2 70.62,94.62 v72,96 | C16.2 56.49,87.09 v55.66,87.09 | C15.2 53.73,78.34 v54.46,77.61 | C10.2 44.13,82.18 v44.13,82.5 | C11.2 41.23,90.49 v41.75,91.01 | C12.2 32.58,95.03 v31.21,96.4 | v21.03,97.03 21.03,96.59 C13.2 | C14.2 10.36,90.3 v10.36,88.6 | C28.2 4.89,81.11 v5.53,80.47 | v4.62,70.82 3.19,72.25 C27.2 | C26.2 6.67,61.32 v6.7,61.32 | C25.2 10.28,52.21 v10.88,52.21 | C24.2 16.31,44.9 v17.22,44.9 | C23.2 23.02,37.08 v23.97,37.08 | C8.2 29.72,29.3 v30.69,29.3 | C22.2 36.51,21.39 v37.51,21.39 39.13,21.39 v39.83,20.69 39.83,18.73 C5.2 | C9.2 48.19,75.17 v47.49,75.17 48.8,76.48 v48.8,77.95
  Bottom 0.508: v85.1,95.4 v82.2,95 | v90.9,89.1 v93.3,88.3 | v95.5,79.7 v97.1,77.8 | U2.8 48.55,44.95 v48.6,44.9 | R2.2 66.29,59.2 64.3,59.2 58.79,53.69 J2.2 60.61,53.69 62.4,51.9 62.4,47.4 61.5,46.5 61.1,46.1 54.76,46.1 v54.37,46.49 | v72,96 72,96.36 v74.01,98.37 | v40.91,24.13 v48.69,24.13 v48.7,24.12

### Text on the board
tPlace: 49
bPlace: + | -